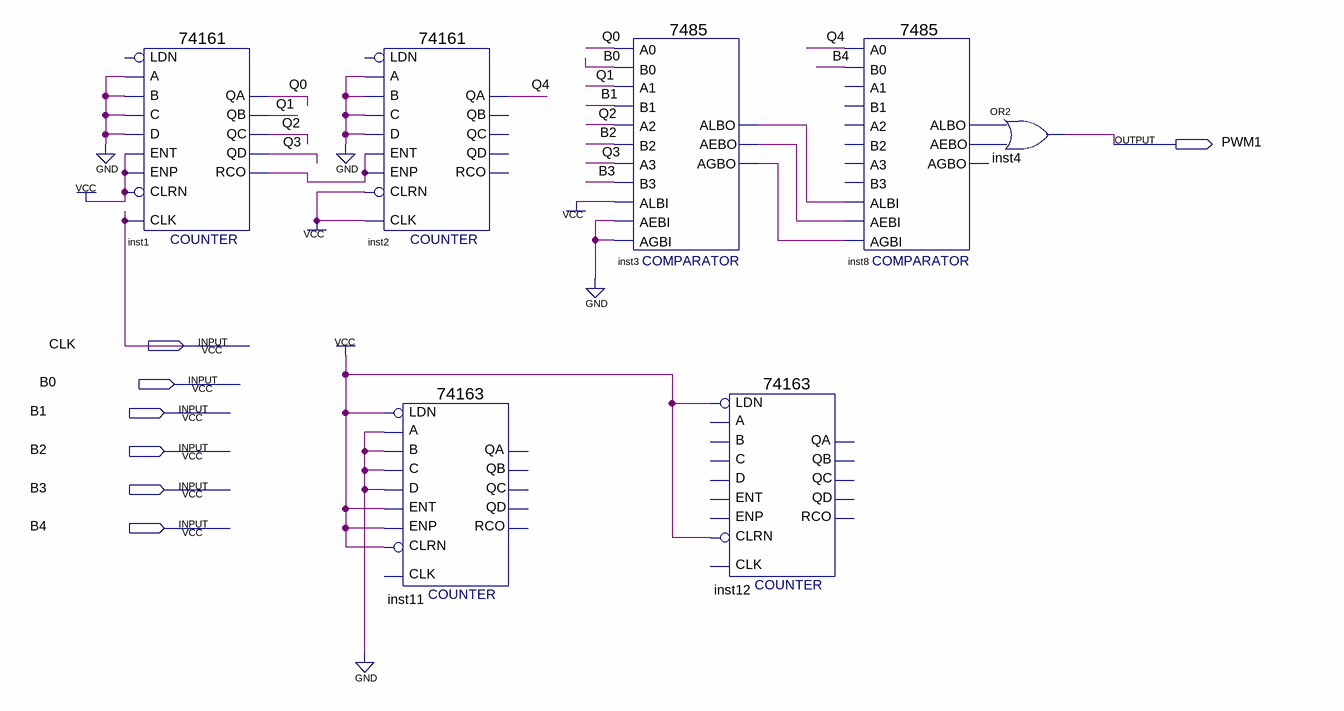
[diagram p0: schematic sheet]
// Quartus schematic pwm.bdf as structural Verilog: 7 symbols, 7 pins
module pwm (
  input  CLK,
  input  B0,
  input  B1,
  input  B2,
  input  B3,
  input  B4,
  output PWM1
);

  wire inst1_rco, inst3_aebo, inst3_agbo, inst3_albo, inst8_aebo, inst8_albo, Q0, Q1, Q2, Q3, Q4;

  \74161  inst1 (
    .CLRN(1'b1), .CLK(CLK), .ENP(1'b1), .A(1'b0), .D(1'b0), .ENT(1'b1), .B(1'b0), .C(1'b0), .QD(Q3), .QC(Q2),
    .QB(Q1), .QA(Q0), .RCO(inst1_rco));  // open: LDN
  \74161  inst2 (
    .CLRN(1'b1), .CLK(1'b1), .ENP(inst1_rco), .A(1'b0), .D(1'b0), .ENT(inst1_rco), .B(1'b0), .C(1'b0), .QA(Q4));  // open: LDN, QD, QC, QB, RCO
  \74163  inst11 (
    .C(1'b0), .B(1'b0), .A(1'b0), .ENT(1'b1), .D(1'b0), .CLRN(1'b1), .ENP(1'b1), .LDN(1'b1));  // open: CLK, QA, QB, QC, QD, RCO
  \7485  inst3 (
    .A3(Q3), .B2(B2), .A2(Q2), .AEBI(1'b0), .AGBI(1'b0), .ALBI(1'b1), .A0(Q0), .B0(B0), .B3(B3), .A1(Q1),
    .B1(B1), .ALBO(inst3_albo), .AGBO(inst3_agbo), .AEBO(inst3_aebo));
  \74163  inst12 (.CLRN(1'b1), .LDN(1'b1));  // open: C, B, A, ENT, D, CLK, ENP, QA, QB, QC, QD, RCO
  \7485  inst8 (
    .AEBI(inst3_aebo), .AGBI(inst3_agbo), .ALBI(inst3_albo), .A0(Q4), .B0(B4), .ALBO(inst8_albo),
    .AEBO(inst8_aebo));  // open: A3, B2, A2, B3, A1, B1, AGBO
  or inst4 (PWM1, inst8_albo, inst8_aebo);
endmodule
